# Altium schematic sheet fetdrivers.SchDoc
size A4
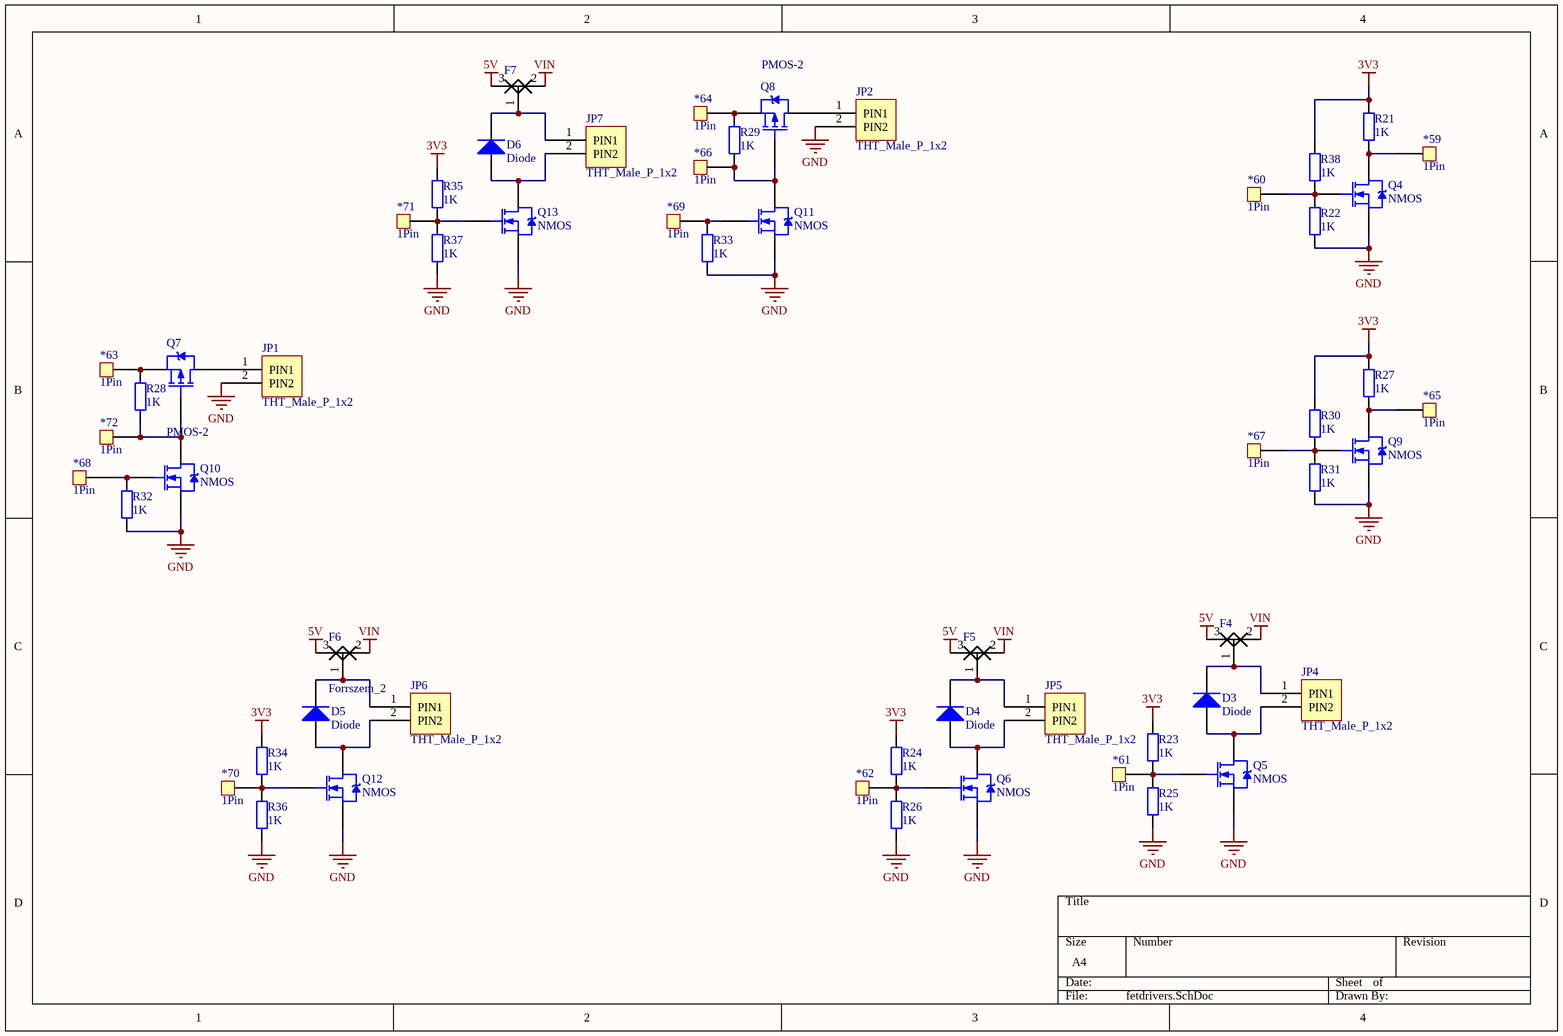
[diagram p0: fetdrivers.SchDoc]

## Parts
*59  1Pin  [Header1]
*60  1Pin  [Header1]
*61  1Pin  [Header1]
*62  1Pin  [Header1]
*63  1Pin  [Header1]
*64  1Pin  [Header1]
*65  1Pin  [Header1]
*66  1Pin  [Header1]
*67  1Pin  [Header1]
*68  1Pin  [Header1]
*69  1Pin  [Header1]
*70  1Pin  [Header1]
*71  1Pin  [Header1]
*72  1Pin  [Header1]
D3  Diode  [DO214]
D4  Diode  [DO214]
D5  Diode  [DO214]
D6  Diode  [DO214]
F4  Forrszem_2  [FORRSZEM3]  (value not drawn)
F5  Forrszem_2  [FORRSZEM3]  (value not drawn)
F6  Forrszem_2  [FORRSZEM3]
F7  Forrszem_2  [FORRSZEM3]  (value not drawn)
JP1  THT_Male_P_1x2  [THT_Male_P_1x2-2.54mm]
JP2  THT_Male_P_1x2  [THT_Male_P_1x2-2.54mm]
JP4  THT_Male_P_1x2  [THT_Male_P_1x2-2.54mm]
JP5  THT_Male_P_1x2  [THT_Male_P_1x2-2.54mm]
JP6  THT_Male_P_1x2  [THT_Male_P_1x2-2.54mm]
JP7  THT_Male_P_1x2  [THT_Male_P_1x2-2.54mm]
Q4  NMOS  [SOT95P245X110-3N]
Q5  NMOS  [SOT95P245X110-3N]
Q6  NMOS  [SOT95P245X110-3N]
Q7  PMOS-2  [SOT95P245X110-3N]
Q8  PMOS-2  [SOT95P245X110-3N]
Q9  NMOS  [SOT95P245X110-3N]
Q10  NMOS  [SOT95P245X110-3N]
Q11  NMOS  [SOT95P245X110-3N]
Q12  NMOS  [SOT95P245X110-3N]
Q13  NMOS  [SOT95P245X110-3N]
R21  value 1K  [0805]  (hidden comment: Resistor)
R22  value 1K  [0805]  (hidden comment: Resistor)
R23  value 1K  [0805]  (hidden comment: Resistor)
R24  value 1K  [0805]  (hidden comment: Resistor)
R25  value 1K  [0805]  (hidden comment: Resistor)
R26  value 1K  [0805]  (hidden comment: Resistor)
R27  value 1K  [0805]  (hidden comment: Resistor)
R28  1K  [FP_0805_RES]
R29  1K  [FP_0805_RES]
R30  value 1K  [0805]  (hidden comment: Resistor)
R31  value 1K  [0805]  (hidden comment: Resistor)
R32  1K  [FP_0805_RES]
R33  1K  [FP_0805_RES]
R34  value 1K  [0805]  (hidden comment: Resistor)
R35  value 1K  [0805]  (hidden comment: Resistor)
R36  value 1K  [0805]  (hidden comment: Resistor)
R37  value 1K  [0805]  (hidden comment: Resistor)
R38  value 1K  [0805]  (hidden comment: Resistor)

## Nets
3V3: R21.2 R23.2 R24.2 R27.2 R30.2 R34.2 R35.2 R38.2
5V: F4.3(A) F5.3(A) F6.3(A) F7.3(A)
GND: JP1.2(PIN2) JP2.2(PIN2) Q4.S Q5.S Q6.S Q9.S Q10.S Q11.S Q12.S Q13.S R22.1 R25.1 R26.1 R31.1 R32.1 R33.1 R36.1 R37.1
VIN: F4.2(C) F5.2(C) F6.2(C) F7.2(C)
Net*59_1: *59.1 Q4.D R21.1
Net*60_1: *60.1 Q4.G R22.2 R38.1
Net*61_1: *61.1 Q5.G R23.1 R25.2
Net*62_1: *62.1 Q6.G R24.1 R26.2
Net*63_1: *63.1 Q7.S R28.2
Net*64_1: *64.1 Q8.S R29.2
Net*65_1: *65.1 Q9.D R27.1
Net*66_1: *66.1 Q8.G Q11.D R29.1
Net*67_1: *67.1 Q9.G R30.1 R31.2
Net*68_1: *68.1 Q10.G R32.2
Net*69_1: *69.1 Q11.G R33.2
Net*70_1: *70.1 Q12.G R34.1 R36.2
Net*71_1: *71.1 Q13.G R35.1 R37.2
Net*72_1: *72.1 Q7.G Q10.D R28.1
NetD3_1: D3.1(A) JP4.2(PIN2) Q5.D
NetD3_2: D3.2(K) F4.1(B) JP4.1(PIN1)
NetD4_1: D4.1(A) JP5.2(PIN2) Q6.D
NetD4_2: D4.2(K) F5.1(B) JP5.1(PIN1)
NetD5_1: D5.1(A) JP6.2(PIN2) Q12.D
NetD5_2: D5.2(K) F6.1(B) JP6.1(PIN1)
NetD6_1: D6.1(A) JP7.2(PIN2) Q13.D
NetD6_2: D6.2(K) F7.1(B) JP7.1(PIN1)
NetJP1_1: JP1.1(PIN1) Q7.D
NetJP2_1: JP2.1(PIN1) Q8.D

## Library data of the parts
JP1 JP2 JP4-JP7 = THT_Male_P_1x2: THT Male pin header strip 1x2
Q4-Q6 Q9-Q13 = NMOS: N-Channel Power MOSFET; pin to pad: D>3 G>1 S>2; Note: Pin 2 is electrically connected to pin 4.; Published: 8-Jun-2000; LatestRevisionDate: 17-Jul-2002; LatestRevisionNote: Re-released for DXP Platform.; DatasheetDocument: PD-9.814; PackageReference: TO-220AB; Publisher: Altium Limited; Code_JEDEC: TO-220-AB; ComponentLink1Description: Manufacturer Link; ComponentLink1URL: http://www.irf.com/
Q7 Q8 = PMOS-2: P-Channel Power MOSFET; pin to pad: D>3 G>1 S>2; Note: Pin 4 not drawn and electrically connected to Pin 2.; Published: 8-Jun-2000; LatestRevisionDate: 17-Jul-2002; LatestRevisionNote: Re-released for DXP Platform.; DatasheetVersion: PD-9.390D; PackageVersion: Feb-1997; PackageReference: TO-220AB; Publisher: Altium Limited; PackageDescription: TO, Thru-Hole, Vertical, Heatsink Mounted; 3 In-Line Leads; Pitch 2.54 mm; ComponentLink1Description: Manufacturer Link; ComponentLink1URL: http://www.irf.com/
R28 R29 R32 R33 = RES: Resistor; Value: 1K
D3-D6 = Diode: Published: 8-Jun-2000; LatestRevisionDate: 17-Jul-2002; LatestRevisionNote: Re-released for DXP Platform.; DatasheetDocument: 6-Aug-1999; PackageReference: DO-35; Publisher: Altium Limited; Code_JEDEC: DO-204-AH; ComponentLink1Description: Manufacturer Link; ComponentLink1URL: http://www.vishay.com/; ComponentLink2Description: Datasheet; ComponentLink2URL: http://www.vishay.com/docs/85588/85588.pdf
R21-R27 R30 R31 R34-R38 = Resistor: Published: 8-Jun-2000; LatestRevisionDate: 17-Jul-2002; LatestRevisionNote: Re-released for DXP Platform.; PackageReference: AXIAL-0.4; Publisher: Altium Limited